# EAGLE design clock_motherboard (EAGLE 7.4.0)
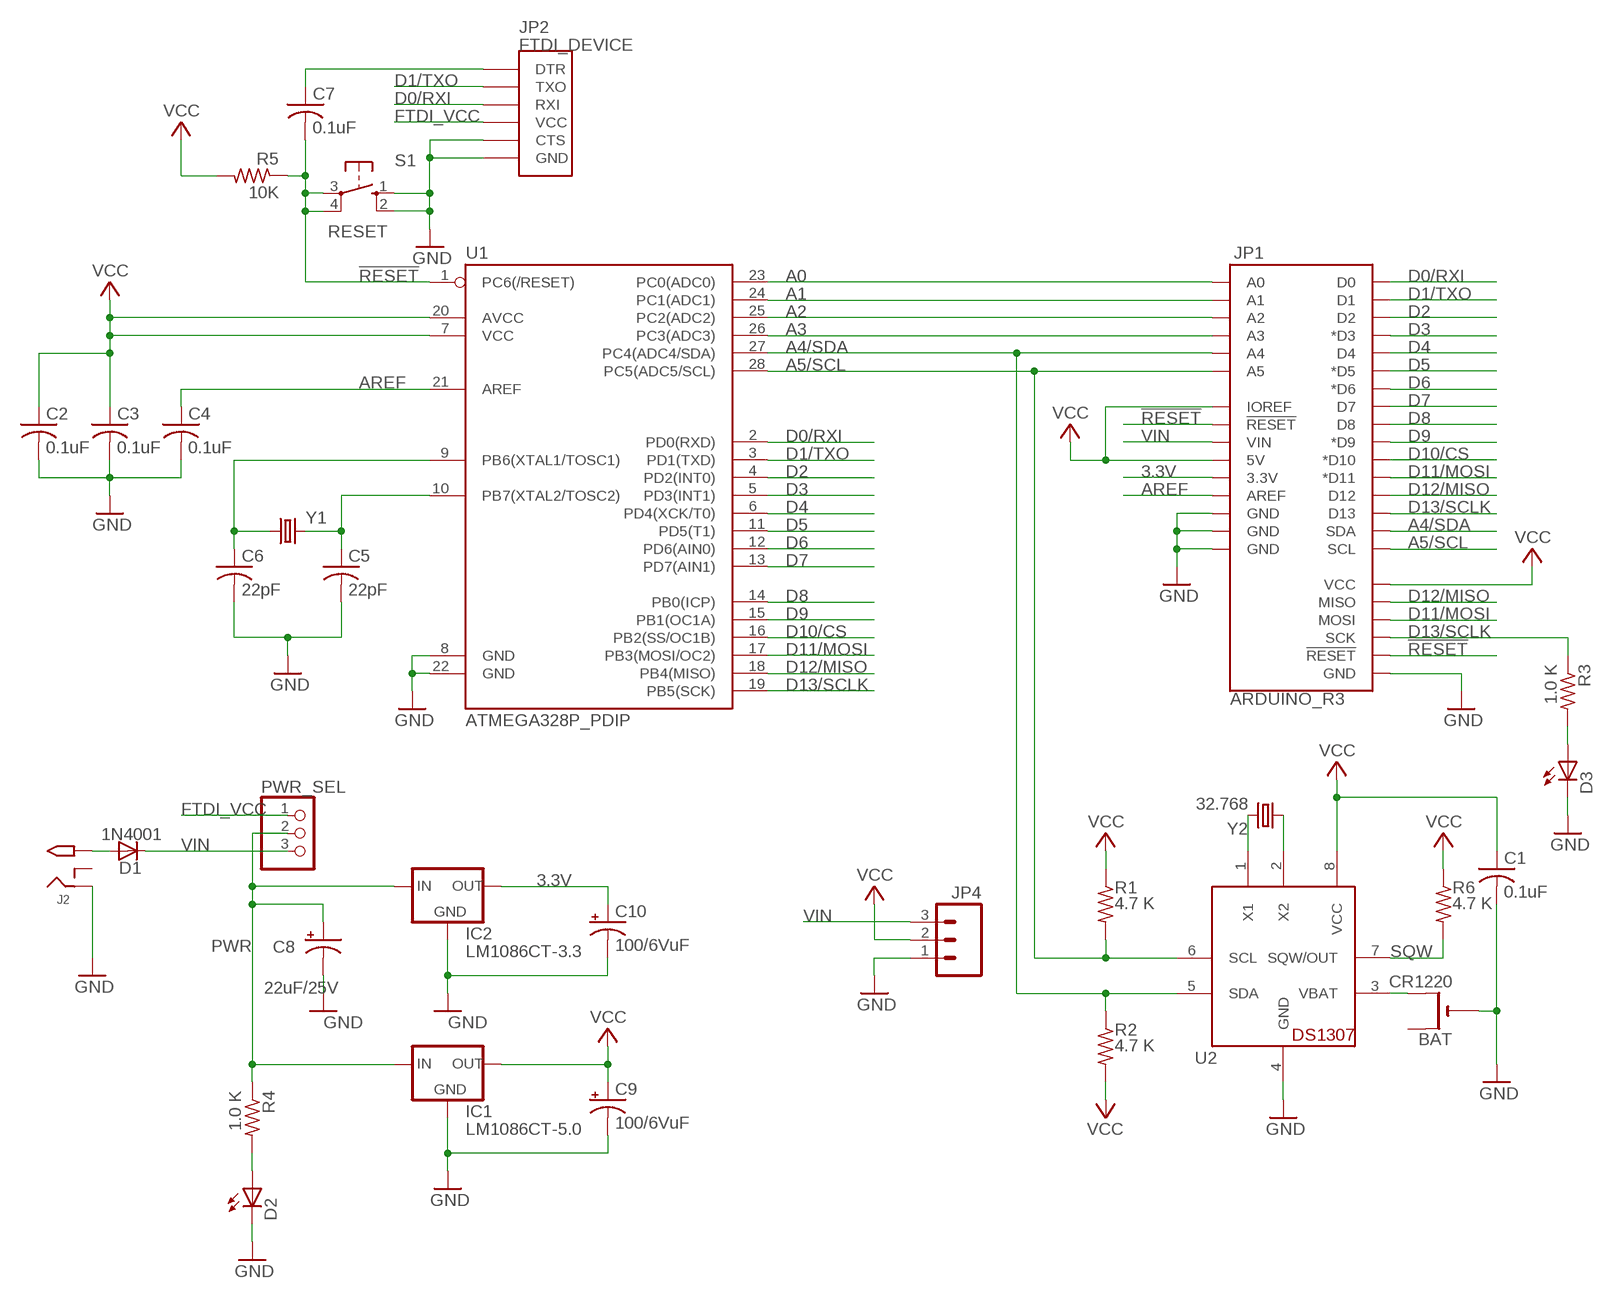
[diagram p0: schematic, sheet 1]

## Parts
BAT  CR1220  CR1220THM  [CR1220-THM]
C1  0.1uF  C-US025-025X050  [C025-025X050]
C2  0.1uF  C-US025-025X050  [C025-025X050]
C3  0.1uF  C-US025-025X050  [C025-025X050]
C4  0.1uF  C-US025-025X050  [C025-025X050]
C5  22pF  C-US025-025X050  [C025-025X050]
C6  22pF  C-US025-025X050  [C025-025X050]
C7  0.1uF  C-US025-025X050  [C025-025X050]
C8  22uF/25V  CPOL-USE2.5-6  [E2,5-6]
C9  100/6VuF  CPOL-USE2.5-6  [E2,5-6]
C10  100/6VuF  CPOL-USE2.5-6  [E2,5-6]
D1  1N4001  1N4004  [DO41-10]
D2  LED3MM  [LED3MM]
D3  LED3MM  [LED3MM]
IC1  LM1086CT-5.0  78XXS  [78XXS]
IC2  LM1086CT-3.3  78XXS  [78XXS]
J2  2.1MMJACK  [PJ-102A]
JP1  ARDUINO_R3  [ARDUINO_R3]
JP2  FTDI_DEVICE  [FTDI_DEVICE_SIDE]
JP4  M03SCREW  [SCREWTERMINAL-3.5MM-3]
PWR_SEL  PINHD-1X3  [1X03]
R1  4.7 K  R-US_0207/5V  [0207/5V]
R2  4.7 K  R-US_0207/5V  [0207/5V]
R3  1.0 K  R-US_0207/5V  [0207/5V]
R4  1.0 K  R-US_0207/5V  [0207/5V]
R5  10K  R-US_0207/5V  [0207/5V]
R6  4.7 K  R-US_0207/5V  [0207/5V]
S1  RESET  10-XX  [B3F-10XX]
U1  ATMEGA328P_PDIP  [DIL28-3]
U2  DS1307  [DIL08]
Y1  CRYSTALHC49US  [HC49US]
Y2  32.768  CRYTALTC38H  [TC38H]

## Nets
3.3V: C10.+ IC2.OUT JP1.3.3V
!RESET: C7.2 JP1.RESET@1(!RESET!) JP1.RESET@2(!RESET!) R5.1 S1.3(P) S1.4(P1) U1.1(PC6(/RESET))
A0: JP1.A0 U1.23(PC0(ADC0))
A1: JP1.A1 U1.24(PC1(ADC1))
A2: JP1.A2 U1.25(PC2(ADC2))
A3: JP1.A3 U1.26(PC3(ADC3))
A4/SDA: JP1.A4 JP1.SDA R2.1 U1.27(PC4(ADC4/SDA)) U2.5(SDA)
A5/SCL: JP1.A5 JP1.SCL R1.2 U1.28(PC5(ADC5/SCL)) U2.6(SCL)
AREF: C4.1 JP1.AREF U1.21(AREF)
D0/RXI: JP1.D0 JP2.P$3(RXI) U1.2(PD0(RXD))
D1/TXO: JP1.D1 JP2.P$2(TXO) U1.3(PD1(TXD))
D2: JP1.D2 U1.4(PD2(INT0))
D3: JP1.D3(*D3) U1.5(PD3(INT1))
D4: JP1.D4 U1.6(PD4(XCK/T0))
D5: JP1.D5(*D5) U1.11(PD5(T1))
D6: JP1.D6(*D6) U1.12(PD6(AIN0))
D7: JP1.D7 U1.13(PD7(AIN1))
D8: JP1.D8 U1.14(PB0(ICP))
D9: JP1.D9(*D9) U1.15(PB1(OC1A))
D10/CS: JP1.D10(*D10) U1.16(PB2(SS/OC1B))
D11/MOSI: JP1.D11(*D11) JP1.MOSI U1.17(PB3(MOSI/OC2))
D12/MISO: JP1.D12 JP1.MISO U1.18(PB4(MISO))
D13/SCLK: JP1.D13 JP1.SCK R3.1 U1.19(PB5(SCK))
FTDI_VCC: JP2.P$4(VCC) PWR_SEL.1
GND: BAT.- C1.2 C2.2 C3.2 C4.2 C5.2 C6.2 C8.- C9.- C10.- D2.K(C) D3.K(C) IC1.GND IC2.GND J2.RING JP1.GND@1(GND) JP1.GND@2(GND) JP1.GND@3(GND) JP1.GND@4(GND) JP2.P$5(CTS) JP2.P$6(GND) JP4.1 S1.1(S) S1.2(S1) U1.8(GND) U1.22(GND) U2.4(GND)
N$1: C6.1 U1.9(PB6(XTAL1/TOSC1)) Y1.1
N$2: C5.1 U1.10(PB7(XTAL2/TOSC2)) Y1.2
N$3: C7.1 JP2.P$1(DTR)
N$4: D3.A R3.2
N$5: D2.A R4.2
N$14: U2.1(X1) Y2.2
N$15: U2.2(X2) Y2.1
N$17: D1.A J2.TIP
N$39: BAT.+2(+1) U2.3(VBAT)
PWR: C8.+ IC1.IN IC2.IN PWR_SEL.2 R4.1
SQW: R6.2 U2.7(SQW/OUT)
VCC: C1.1 C2.1 C3.1 C9.+ IC1.OUT JP1.5V JP1.IOREF JP1.VCC JP4.2 R1.1 R2.2 R5.2 R6.1 U1.7(VCC) U1.20(AVCC) U2.8(VCC)
VIN: D1.C JP1.VIN JP4.3 PWR_SEL.3
Unconnected: BAT.+1(+) J2.RING_SW

## Library data of the parts
BAT = adafruit:CR1220: CR1216/CR1220/CR1225 12mm 3V lithium coin cell Great for battery packup. Both SMT and THM holders. Note the THM package has the ground pads on both sides of the PCB so that the masks are the same - this reduces the cost
C1-C7 = adafruit:C-US: CAPACITOR, American symbol
C8-C10 = minimidi:CPOL-US: POLARIZED CAPACITOR, American symbol
D1 = minimidi:1N4004: DIODE general purpose rectifier, 1 A
D2 D3 = minimidi:LED: LED OSRAM: - CHIPLED LG R971, LG N971, LY N971, LG Q971, LY Q971, LO R971, LY R971 LH N974, LH R974 LS Q976, LO Q976, LY Q976 LO Q996 - Hyper CHIPLED LW Q18S LB Q993, LB Q99A, LB R99A - SideLED LS A670, LO A670, LY A670, LG A670, LP A670 LB A673, LV A673, LT A673, LW A673 LH A674 LY A675 LS A676, LA A676, LO A676, LY A676, LW A676 LS A679, LY A679, LG A679 - Hyper Micro SIDELED® LS Y876, LA Y876, LO Y876, LY Y876 LT Y87S - SmartLED LW L88C, LW L88S LB L89C, LB L89S, LG L890 LS L89K, LO L89K, LY L89K LS L896, LA L896, LO L896, LY L896 - TOPLED LS T670, LO T670, LY T670, LG T670, LP T670 LSG T670, LSP T670, LSY T670, LOP T670, LYG T670 LG T671, LOG T671, LSG T671 LB T673, LV T673, LT T673, LW T673 LH T674 LS T676, LA T676, LO T676, LY T676, LB T676, LH T676, LSB T676, LW T676 LB T67C, LV T67C, LT T67C, LS T67K, LO T67K, LY T67K, LW E67C LS E67B, LA E67B, LO E67B, LY E67B, LB E67C, LV E67C, LT E67C LW T67C LS T679, LY T679, LG T679 LS T770, LO T770, LY T770, LG T770, LP T770 LB T773, LV T773, LT T773, LW T773 LH T774 LS E675, LA E675, LY E675, LS T675 LS T776, LA T776, LO T776, LY T776, LB T776 LHGB T686 LT T68C, LB T68C - Hyper Mini TOPLED® LB M676 - Mini TOPLED Santana® LG M470 LS M47K, LO M47K, LY M47K Source: http://www.osram.convergy.de/
IC1 IC2 = v-reg:78XXS: VOLTAGE REGULATOR
J2 = minimidi:2.1MMJACK
JP1 = clock_motherboard:ARDUINO_R3: Arduino R3 Footprint (w/ SPI header)
JP2 = clock_motherboard:FTDI_DEVICE: Connector which mates to FTDI basic or FTDI cable.
JP4 = SparkFun-Connectors:M03: Header 3 Standard 3-pin 0.1" header. Use with straight break away headers (SKU : PRT-00116), right angle break away headers (PRT-00553), swiss pins (PRT-00743), machine pins (PRT-00117), and female headers (PRT-00115). Molex polarized connector foot print use with SKU : PRT-08232 with associated crimp pins and housings.; PROD_ID: CONN-08288
PWR_SEL = pinhead:PINHD-1X3: PIN HEADER
R1-R4 R6 = minimidi:R-US_: RESISTOR, American symbol
R5 = rcl-ez:R-US_: RESISTOR, American symbol
S1 = switch-omron:10-XX: OMRON SWITCH; MPN: B3F-1000; OC_FARNELL: 176432; OC_NEWARK: 36M3542
U1 = SparkFun-DigitalIC:ATMEGA328P_PDIP: uC used in the Arduino 32kb flash, 1k EEPROM, 2k SRAM This is the through-hole version of this chip.
U2 = adafruit:DS1307: DS1307 Real time clock (RTC) with battery backup ability. Talk to it via i2c
Y1 = SparkFun-FreqCtrl:CRYSTAL: Various standard crystals. Proven footprints.
Y2 = crystal:CRYTAL: CRYSTAL

## Net classes
1 power: width 0.61 mm, drill 0.61 mm, clearance 0.254 mm
2 gnd: width 0.305 mm, drill 0.559 mm, clearance 0.254 mm

## Board
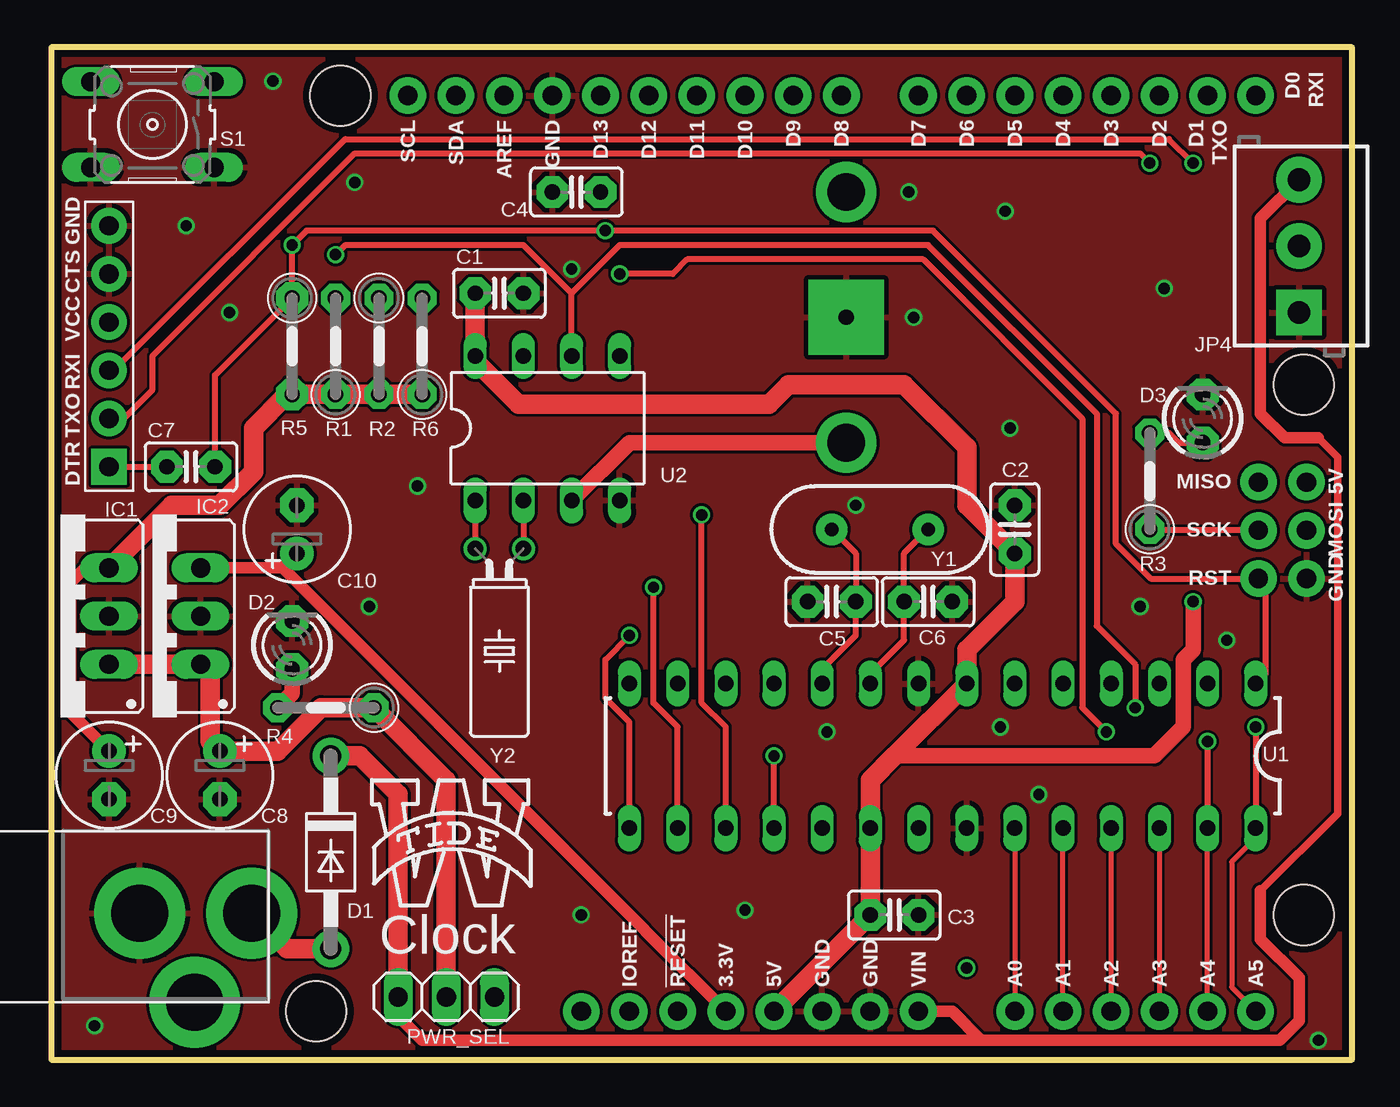
[diagram p1: board, top side]
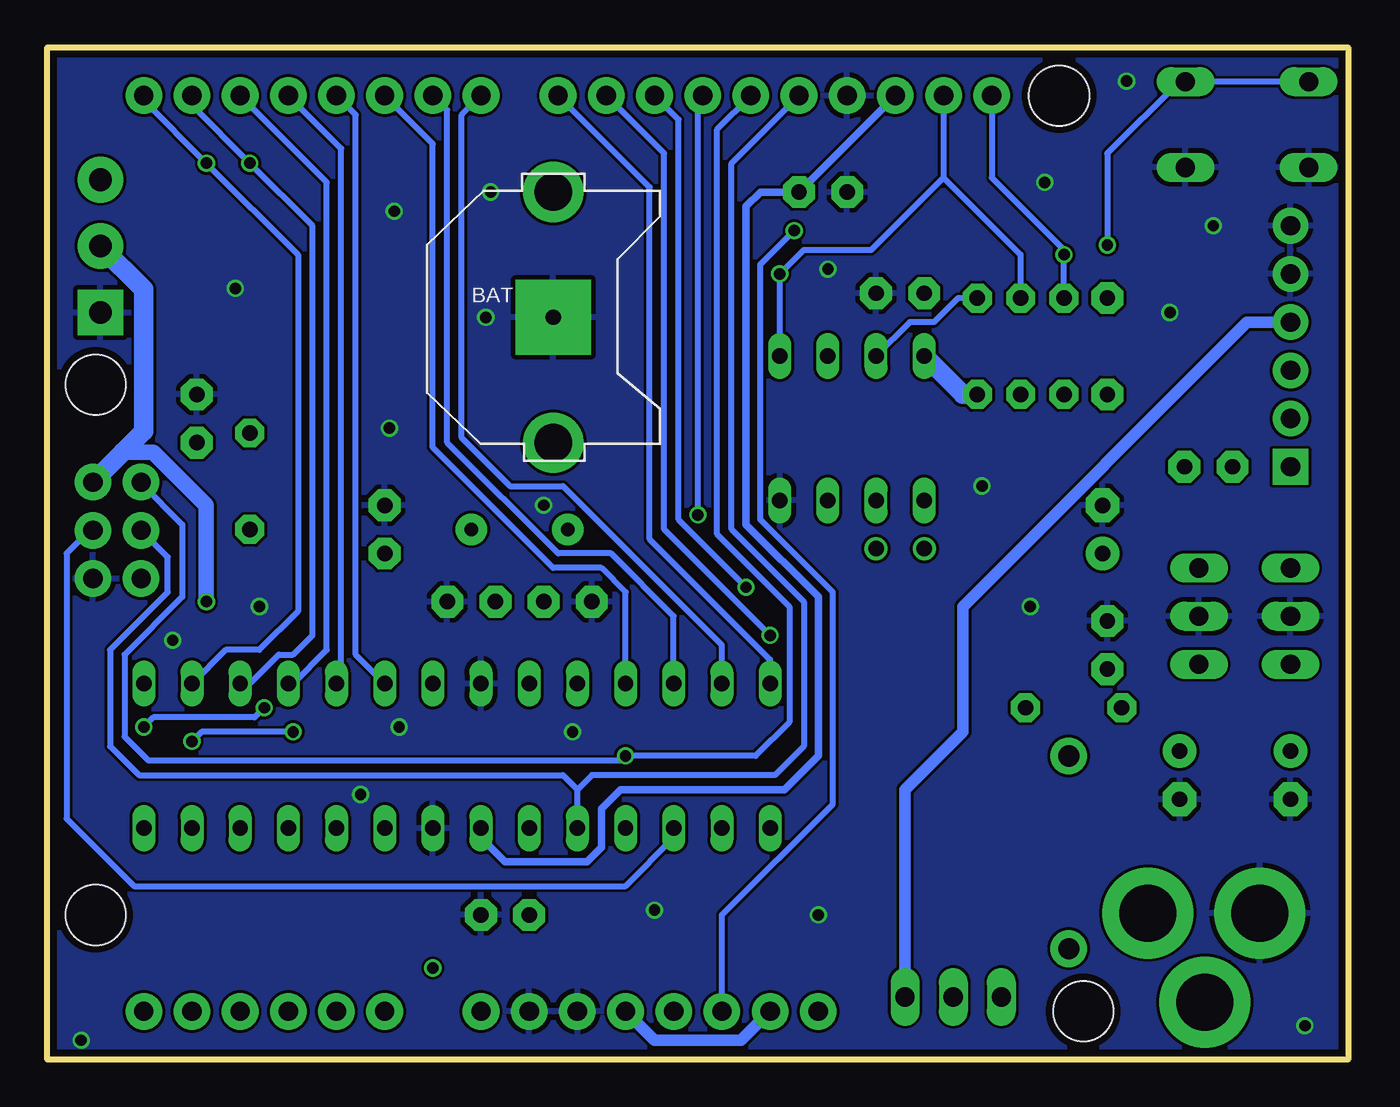
[diagram p2: board, bottom side, seen from below]

Size 68.58 x 53.34 mm. Coordinates in mm from the lower left corner, seen from the top.
Outline: 0,0 68.58,0 68.58,53.34 0,53.34 0,0
Copper layers (1*16): Top 0.035559375mm / dielectric 1.6mm / Bottom 0.035559375mm
Design rules "oshpark-2layer": minimum track width 6mil, minimum drill 10mil, track to track 6mil, track to pad 6mil, pad to pad 6mil, via to via 6mil, smd to smd 6mil, copper to edge 15mil, drill to drill 6mil, minimum pad ring 5mil, minimum via ring 5mil, stop-mask expansion 2.5mil, vias tented up to drill 0mil, thermal gap 10mil

### Footprints (pad centres in the part's own frame; a part is rotated, then mirrored left to right if it is on the bottom)
CR1220-THM = drill 2 pad 3.175: +1 -6.604,0; +2 6.604,0 | drill 0.8 pad 3.962 square: - 0,0
C025-025X050 = drill 0.813 pad 1.676 octagon: 1 -1.27,0; 2 1.27,0
E2,5-6 = drill 0.813 pad 1.778: + -1.27,0 | drill 0.813 pad 1.778 octagon: - 1.27,0
DO41-10 = drill 1.118 pad 1.93: A 5.08,0; C -5.08,0
LED3MM = drill 0.813 pad 1.676 octagon: A -1.27,0; K 1.27,0
78XXS = drill 1.016 long: GND 0,-2.54; IN -2.54,-2.54; OUT 2.54,-2.54
PJ-102A = drill 3 pad 4.8: RING 0.1,-3.39; RING_SW -4.6,-6.29; TIP 0.1,-9.29
ARDUINO_R3 = drill 1.016 pad 1.93: 3.3V 35.56,2.54; 5V 38.1,2.54; A0 50.8,2.54; A1 53.34,2.54; A2 55.88,2.54; A3 58.42,2.54; A4 60.96,2.54; A5 63.5,2.54; AREF 23.876,50.8; D0 63.5,50.8; D1 60.96,50.8; D2 58.42,50.8; D3 55.88,50.8; D4 53.34,50.8; D5 50.8,50.8; D6 48.26,50.8; D7 45.72,50.8; D8 41.656,50.8; D9 39.116,50.8; D10 36.576,50.8; D11 34.036,50.8; D12 31.496,50.8; D13 28.956,50.8; GND@1 40.64,2.54; GND@2 43.18,2.54; GND@3 26.416,50.8; GND@4 66.18,25.35; IOREF 30.48,2.54; MISO 63.64,30.43; MOSI 66.18,27.89; NC 27.94,2.54; RESET@1 33.02,2.54; RESET@2 63.64,25.35; SCK 63.64,27.89; SCL 18.796,50.8; SDA 21.336,50.8; VCC 66.18,30.43; VIN 45.72,2.54 | hole 3.175: 15.24,50.8; 66.04,35.56; 66.04,7.62; 13.97,2.54
FTDI_DEVICE_SIDE = drill 1.016 pad 1.88 square: P$1 -6.35,0 | drill 1.016 pad 1.88: P$2 -3.81,0; P$3 -1.27,0; P$4 1.27,0; P$5 3.81,0; P$6 6.35,0
SCREWTERMINAL-3.5MM-3 = drill 1.2 pad 2.413 square: 1 0,0 | drill 1.2 pad 2.413: 2 3.5,0; 3 7,0
1X03 = drill 1.016 long: 1 -2.54,0; 2 0,0; 3 2.54,0
0207/5V = drill 0.813 pad 1.524 octagon: 1 -2.54,0; 2 2.54,0
0207/5V' = drill 0.813 pad 1.676 octagon: 1 -2.54,0; 2 2.54,0
B3F-10XX = drill 1.016 long: 1 -3.251,2.261; 2 3.251,2.261; 3 -3.251,-2.261; 4 3.251,-2.261
DIL28-3 = drill 0.813 long: 1 -16.51,-3.81; 2 -13.97,-3.81; 3 -11.43,-3.81; 4 -8.89,-3.81; 5 -6.35,-3.81; 6 -3.81,-3.81; 7 -1.27,-3.81; 8 1.27,-3.81; 9 3.81,-3.81; 10 6.35,-3.81; 11 8.89,-3.81; 12 11.43,-3.81; 13 13.97,-3.81; 14 16.51,-3.81; 15 16.51,3.81; 16 13.97,3.81; 17 11.43,3.81; 18 8.89,3.81; 19 6.35,3.81; 20 3.81,3.81; 21 1.27,3.81; 22 -1.27,3.81; 23 -3.81,3.81; 24 -6.35,3.81; 25 -8.89,3.81; 26 -11.43,3.81; 27 -13.97,3.81; 28 -16.51,3.81
DIL08 = drill 0.813 long: 1 -3.81,-3.81; 2 -1.27,-3.81; 3 1.27,-3.81; 4 3.81,-3.81; 5 3.81,3.81; 6 1.27,3.81; 7 -1.27,3.81; 8 -3.81,3.81
HC49US = drill 0.7 pad 1.651: 1 -2.54,0; 2 2.54,0
TC38H = drill 0.813: 1 -1.27,0; 2 1.27,0

### Placement (x,y rotation side)
BAT  41.91,39.12 270 bottom
C1  23.62,40.39 0 top
C2  50.8,27.94 90 top
C3  44.45,7.62 0 top
C4  27.69,45.72 180 top
C5  41.15,24.13 180 top
C6  46.23,24.13 0 top
C7  7.37,31.24 0 top
C8  8.89,14.99 270 top
C9  3.05,14.99 270 top
C10  12.95,27.94 90 top
D1  14.73,10.92 270 top
D2  12.7,21.84 90 top
D3  60.71,33.78 90 top
IC1  0.51,23.37 90 top
IC2  5.33,23.37 90 top
J2  1.27,7.62 90 top
JP1  0,0 0 top
JP2  3.05,37.59 90 top
JP4  65.79,39.37 90 top
PWR_SEL  20.83,3.3 180 top
R1  14.99,37.59 90 top
R2  17.27,37.59 270 top
R3  57.91,30.48 90 top
R4  14.48,18.54 180 top
R5  10K  [0207/5V']  12.7,37.59 270 top
R6  19.56,37.59 90 top
S1  5.33,49.28 180 top
U1  46.99,16 180 top
U2  26.16,33.27 0 top
Y1  43.69,27.94 180 top
Y2  23.62,26.92 180 top

### Tracks (layer width: path | path; a pad name or v marks a point on that pad's centre or on a via)
3.3V
  Top 0.61: IC2.OUT 12.19,25.91 | 12.19,25.91 C10.+ | 12.19,25.91 31.11,6.99 31.5,6.6 JP1.3.3V
!RESET  (via drill 0.6)
  Top 0.305: 63.59,25.4 JP1.RESET@2 | JP1.RESET@2 63.64,25.26 64.01,24.89 64.01,20.32 U1.1 | JP1.RESET@2 57.96,25.35 56.13,27.18 56.13,34.04 46.48,43.69 v29.21,43.69 13.46,43.69 v12.7,42.93 R5.1 8.64,36.07 C7.2
  Bottom 0.305: S1.4 S1.3 8.91,51.54 12.7,47.75 v12.7,42.93 | JP1.RESET@1 33.02,7.62 27.18,13.46 27.18,24.64 30.99,28.45 30.99,41.91 v29.21,43.69
A0
  Top 0.254: U1.23 JP1.A0
A1
  Top 0.254: JP1.A1 U1.24
A2
  Top 0.254: JP1.A2 U1.25
A3
  Top 0.254: U1.26 JP1.A3
A4/SDA  (via drill 0.6)
  Top 0.254: JP1.A4 60.96,11.68 U1.27
  Top 0.305: v55.63,17.27 54.36,18.54 54.36,33.78 45.97,42.16 33.53,42.16 32.77,41.4 v29.97,41.4 | v60.96,16.76 60.96,11.68
  Bottom 0.305: JP1.SDA 21.34,46.48 | 21.34,46.48 17.27,42.42 R2.1 17.53,40.13 | U2.5 v29.97,41.4 28.7,42.67 25.15,42.67 21.34,46.48 | v55.63,17.27 60.45,17.27 v60.96,16.76
A5/SCL  (via drill 0.6)
  Top 0.254: U1.28 63.5,11.68 62.23,10.41 62.23,3.81 JP1.A5
  Top 0.305: v57.15,18.54 57.15,20.83 55.12,22.86 55.12,34.04 46.23,42.93 29.97,42.93 27.43,40.39 | v63.5,17.53 U1.28 | U2.6 27.43,40.39 | 27.43,40.39 24.89,42.93 15.49,42.93 v14.99,42.42
  Bottom 0.305: 14.99,39.88 R1.2 v14.99,42.42 14.99,42.67 18.8,46.48 JP1.SCL | v57.15,18.54 57.66,18.03 62.99,18.03 v63.5,17.53
AREF
  Bottom 0.406: U1.21 45.72,11.68 44.45,10.41 40.13,10.41 39.37,11.18 39.37,13.21 38.35,14.22 29.72,14.22 27.94,16 27.94,24.38 31.75,28.19 31.75,44.96 30.99,45.72 C4.1 JP1.AREF
D0/RXI  (via drill 0.6)
  Top 0.305: JP2.P$3 3.3,36.32 15.49,48.51 58.93,48.51 v60.2,47.24
  Bottom 0.305: U1.2 59.18,21.59 57.4,21.59 55.37,23.62 55.37,42.42 v60.2,47.24 63.5,50.55 JP1.D0
D1/TXO  (via drill 0.6)
  Top 0.305: JP2.P$2 3.81,33.78 5.33,35.31 5.33,37.08 16,47.75 57.4,47.75 v57.91,47.24
  Bottom 0.305: U1.3 57.91,19.81 56.39,21.34 55.63,21.34 54.61,22.35 54.61,43.94 v57.91,47.24 60.96,50.29 JP1.D1
D2
  Bottom 0.305: U1.4 55.63,19.81 53.85,21.59 53.85,46.23 JP1.D2
D3
  Bottom 0.305: JP1.D3 53.09,48.01 53.09,20.07 U1.5
D4
  Bottom 0.305: JP1.D4 52.32,49.78 52.32,21.34 U1.6
D5
  Bottom 0.305: JP1.D5 48.26,48.26 48.26,32.26 41.91,25.91 39.37,25.91 38.1,24.64 U1.11
D6
  Bottom 0.305: U1.12 35.56,23.37 38.86,26.67 41.66,26.67 47.5,32.51 47.5,50.04 JP1.D6
D7
  Bottom 0.305: U1.13 33.02,21.84 41.4,30.23 44.2,30.23 46.74,32.77 46.74,49.78 JP1.D7
D8
  Bottom 0.305: U1.14 30.48,21.08 36.83,27.43 36.83,45.97 JP1.D8
D9  (via drill 0.6)
  Top 0.305: U1.15 30.48,17.78 29.21,19.05 29.21,21.08 v30.48,22.35
  Bottom 0.305: v30.48,22.35 36.07,27.94 36.07,47.75 JP1.D9
D10/CS  (via drill 0.6)
  Top 0.305: U1.16 33.02,17.53 31.75,18.8 v31.75,24.89
  Bottom 0.305: v31.75,24.89 35.31,28.45 35.31,49.53 JP1.D10
D11/MOSI  (via drill 0.6)
  Top 0.305: U1.17 35.56,17.53 34.29,18.8 v34.29,28.7
  Bottom 0.305: JP1.MOSI 66.34,27.89 67.56,26.67 67.56,12.7 64.01,9.14 38.1,9.14 35.56,11.68 U1.17 | v34.29,28.7 34.29,50.55 JP1.D11
D12/MISO  (via drill 0.6)
  Top 0.305: U1.18 v38.1,16
  Bottom 0.305: JP1.MISO 63.64,30.37 61.47,28.19 61.47,24.38 64.52,21.34 64.52,17.02 63.25,15.75 38.35,15.75 v38.1,16 31.24,16 29.46,17.78 29.46,23.88 33.27,27.69 33.27,49.02 JP1.D12
D13/SCLK
  Top 0.305: JP1.SCK 57.96,27.89 R3.1
  Bottom 0.305: U1.19 40.64,14.22 | 40.64,14.22 41.4,14.99 63.75,14.99 65.28,16.51 65.28,21.59 62.23,24.64 62.23,26.48 JP1.SCK | 40.64,14.22 39.88,14.99 30.23,14.99 28.7,16.51 28.7,24.13 32.51,27.94 32.51,47.24 JP1.D13
FTDI_VCC
  Bottom 0.61: PWR_SEL.1 23.37,14.22 20.32,17.27 20.32,23.88 5.33,38.86 JP2.P$4
GND  (via drill 0.6)
  other vias: 7.11,43.94 16,46.23 9.4,39.37 11.68,51.56 16.76,23.88 2.29,1.78 27.94,7.62 36.58,7.87 52.07,13.97 40.89,17.27 50.04,17.53 57.4,23.88 58.67,40.64 50.55,33.27 19.3,30.23 45.47,39.12 42.42,29.21 50.29,44.7 45.21,45.72 27.43,41.66 61.98,22.1 66.8,1.02
  pour Bottom: 0,53.34 68.58,53.34 68.58,51.82 68.58,0 0,0 0,2.29
  pour Top: 0,53.34 68.58,53.34 68.58,52.58 68.58,0 0,0
N$1
  Top 0.305: U1.9 43.18,20.32 44.96,22.1 C6.1 44.96,26.67 Y1.1
N$2
  Top 0.305: U1.10 40.64,20.57 42.42,22.35 C5.1 42.42,26.67 Y1.2
N$3
  Top 0.305: JP2.P$1 C7.1
N$4
  Top 0.305: R3.2 58.93,33.02 59.44,32.51 D3.A
N$5
  Top 0.813: D2.A 12.7,19.3 R4.2
N$14
  Top 0.305: U2.1 Y2.2
N$15
  Top 0.305: U2.2 Y2.1
N$17
  Top 1.016: D1.A 12.44,5.84 J2.TIP
N$18  (via drill 0.6)
  other vias: 48.26,4.83
N$39
  Top 0.813: U2.3 30.48,32.51 BAT.+2
PWR
  Top 1.016: PWR_SEL.2 20.83,14.73 R4.1 14.22,18.54 11.94,16.26 C8.+ 8.38,16.76 8.38,20.32 IC2.IN IC1.IN
SQW
  Bottom 0.305: R6.2 20.57,40.13 21.84,38.86 23.11,38.86 U2.7
VCC  (via drill 0.6)
  Top 0.61: IC1.OUT 1.78,25.91 1.02,25.15 1.02,18.29 C9.+
  Top 0.813: v60.2,24.13 60.2,21.59 59.69,21.08 59.69,17.53 58.17,16 44.45,16 | U2.8 22.35,36.83 | 12.45,35.05 R5.2
  Top 1.016: R6.1 R2.2 R1.1 R5.2 | C1.1 U2.8 | 22.35,36.83 24.64,34.54 37.85,34.54 38.86,35.56 44.96,35.56 48.26,32.26 48.26,29.21 C2.1 50.8,24.13 48.26,21.59 U1.7 44.45,16 43.18,14.73 U1.20 C3.1 JP1.5V | IC1.OUT 6.35,29.21 8.89,29.21 10.67,30.99 10.67,33.27 12.45,35.05
  Bottom 0.61: JP1.IOREF 32,1.02 36.58,1.02 JP1.5V
  Bottom 0.813: 64.61,32 62.99,32 60.2,29.21 v60.2,24.13
  Bottom 1.016: R6.1 20.32,35.05 U2.8 | JP1.VCC 64.61,32 63.5,33.11 63.5,40.58 JP4.2
VIN
  Top 0.406: 63.75,8.89 67.82,12.95 67.82,31.75 66.8,32.77
  Top 0.61: PWR_SEL.3 18.29,2.29 19.56,1.02 49.02,1.02 | 49.02,1.02 64.77,1.02 65.79,2.03 65.79,4.32 63.75,6.35 63.75,8.89 | JP4.3 63.75,44.34 63.75,34.04 65.02,32.77 66.8,32.77 | JP1.VIN 47.5,2.54 49.02,1.02
  Top 1.016: D1.C 16.26,16 18.29,13.97 PWR_SEL.3

### Text on the board
tPlace: Clock